# EAGLE design Frankie_KIT (EAGLE 9.1.2)
FRANKIE 1.0
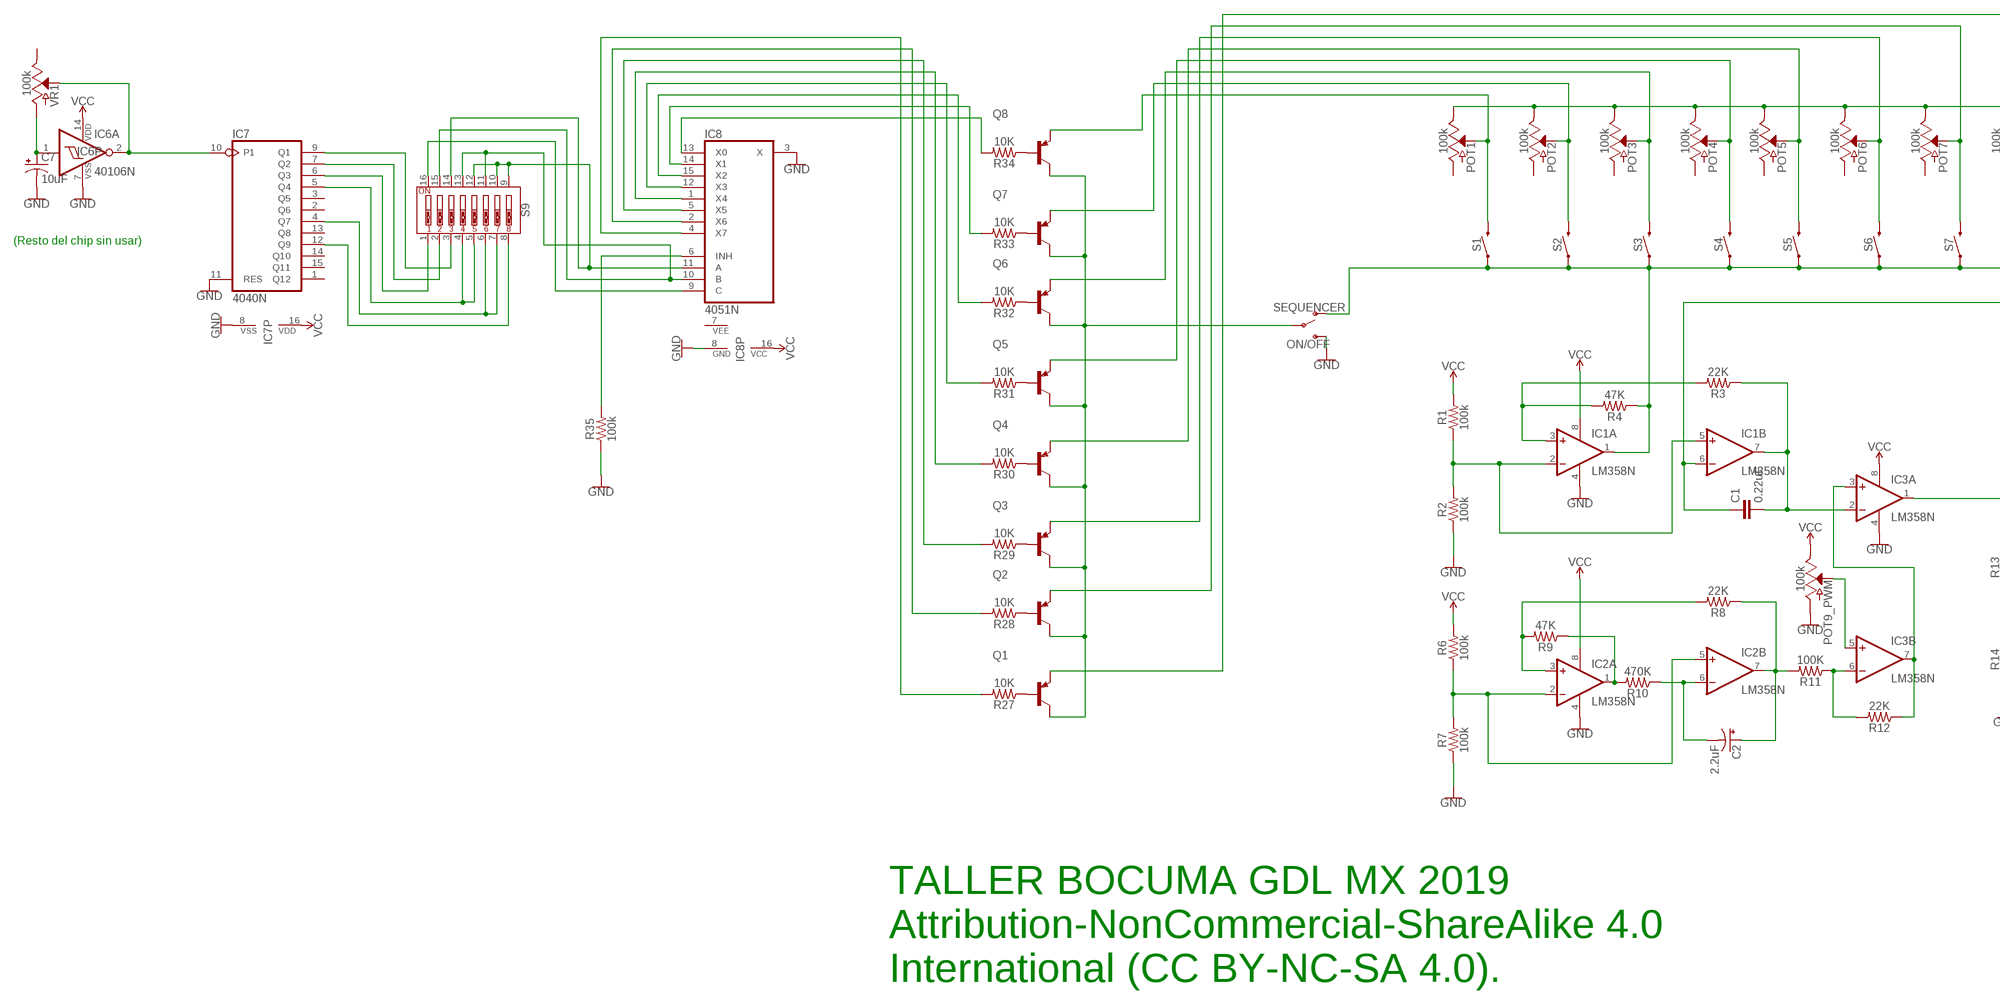
[diagram p0: schematic, sheet 1, part 1 of 2]
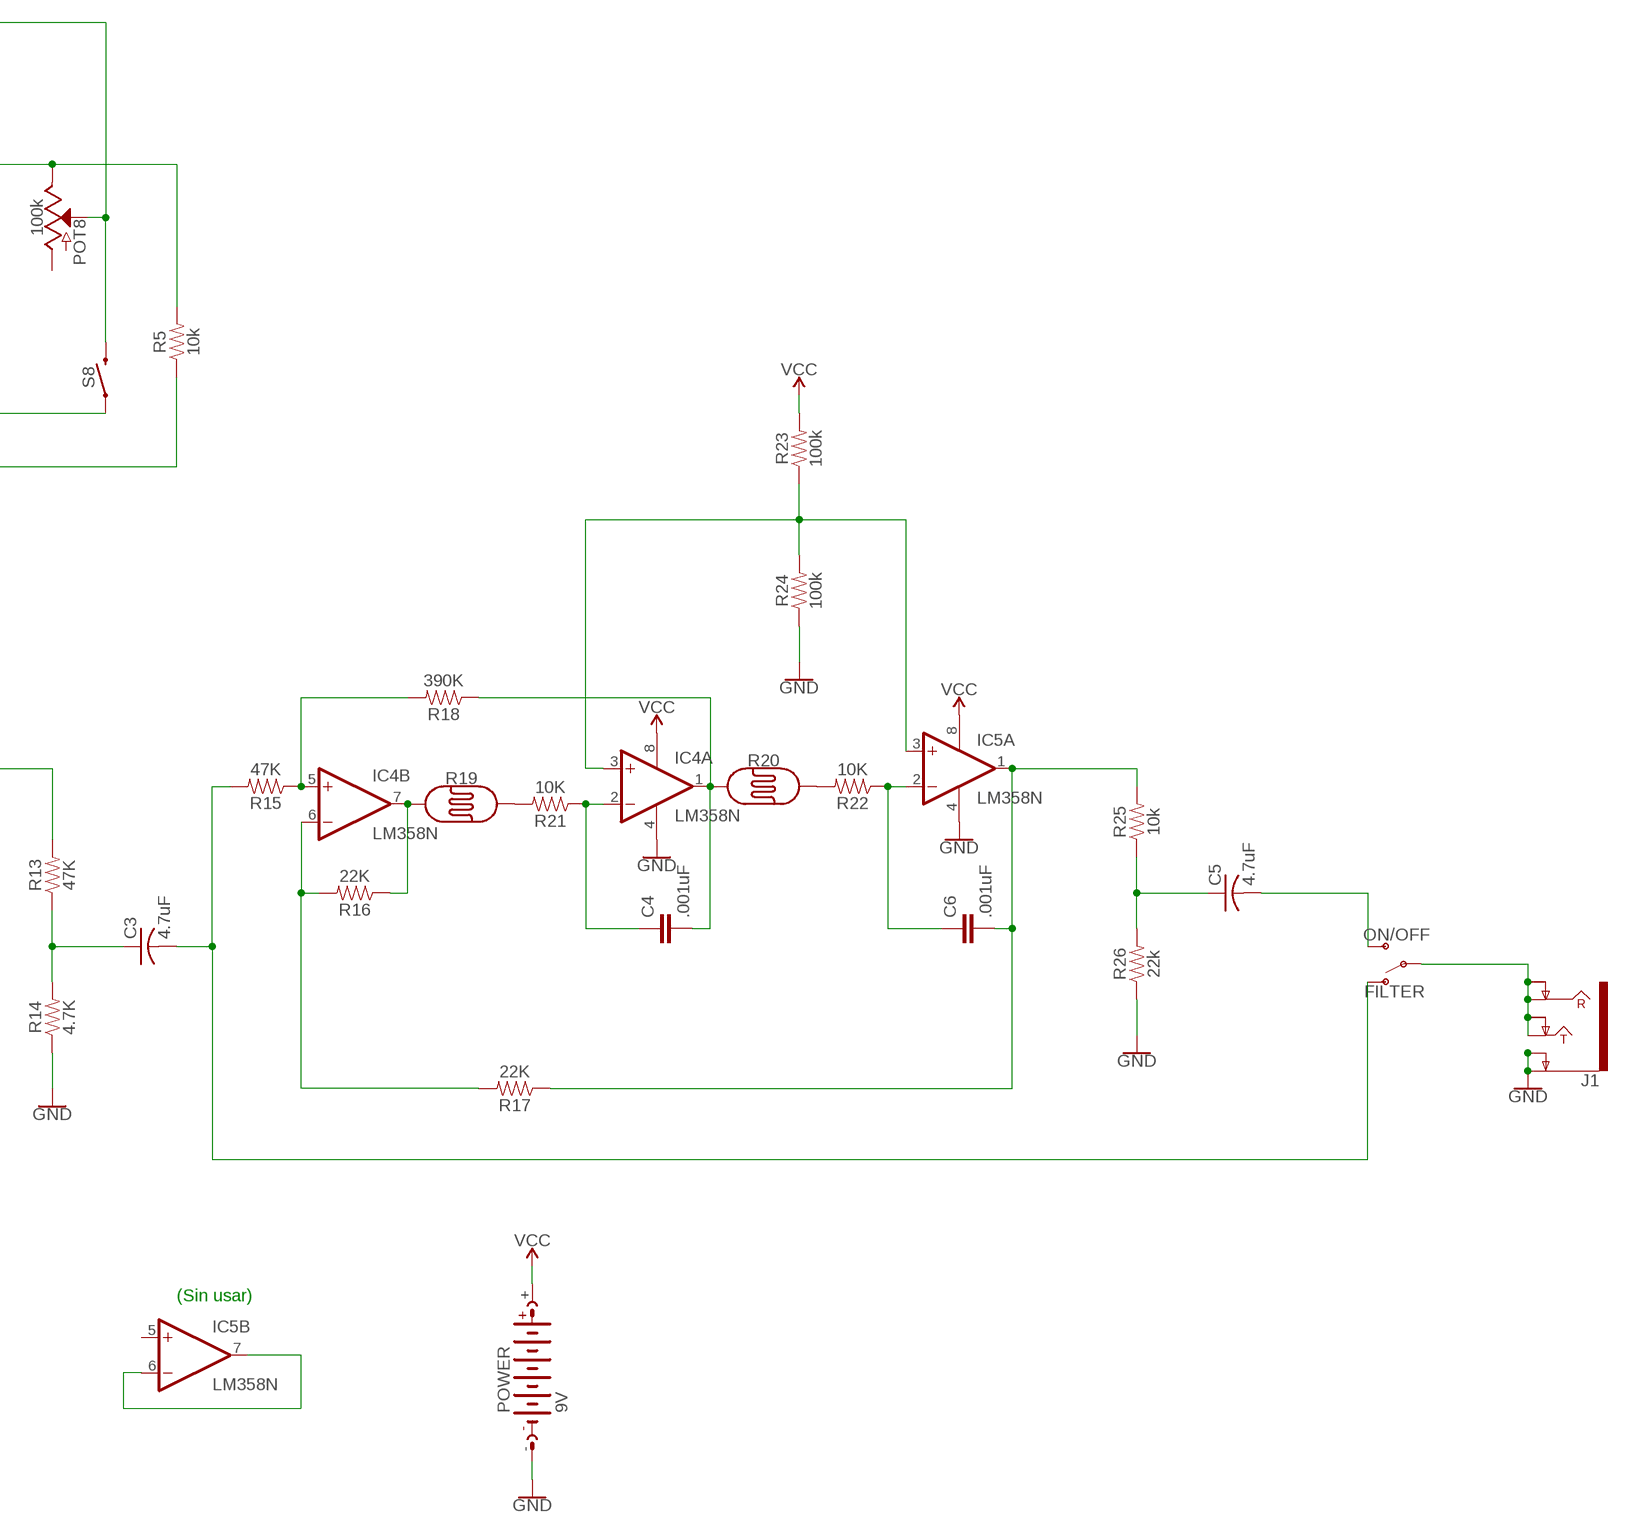
[diagram p1: schematic, sheet 1, part 2 of 2]

## Parts
C1  0.22uF  C5/2.5  [C5B2.5]
C2  2.2uF  10UF-POLAR-RADIAL-2.5MM-KIT-25V-20%  [CPOL-RADIAL-2.5MM-5MM-KIT]
C3  4.7uF  C-US050-025X075  [C050-025X075]
C4  .001uF  C5/2.5  [C5B2.5]
C5  4.7uF  C-US050-025X075  [C050-025X075]
C6  .001uF  C5/2.5  [C5B2.5]
C7  10uF  10UF-POLAR-RADIAL-2.5MM-KIT-25V-20%  [CPOL-RADIAL-2.5MM-5MM-KIT]
FILTER  ON/OFF  SWITCH-SPDT-PTH-11.6X4.0MM-KIT  [SWITCH_SPDT_PTH_11.6X4.0MM_KIT]
IC1  LM358N  [DIL08]
IC2  LM358N  [DIL08]
IC3  LM358N  [DIL08]
IC4  LM358N  [DIL08]
IC5  LM358N  [DIL08]
IC6  40106N  [DIL14]
IC7  4040N  [DIL16]
IC8  4051N  [DIL16]
J1  AUDIO_JACK_TRS_0.25"_PTH_RA  [AUDIO_JACK_0.25"_TRS_PTH_RA]
POT1  100k  POTENTIOMETER-PTH-9MM-1/20W-20%-KIT  [POT-PTH-ALPS-KIT]
POT2  100k  POTENTIOMETER-PTH-9MM-1/20W-20%-KIT  [POT-PTH-ALPS-KIT]
POT3  100k  POTENTIOMETER-PTH-9MM-1/20W-20%-KIT  [POT-PTH-ALPS-KIT]
POT4  100k  POTENTIOMETER-PTH-9MM-1/20W-20%-KIT  [POT-PTH-ALPS-KIT]
POT5  100k  POTENTIOMETER-PTH-9MM-1/20W-20%-KIT  [POT-PTH-ALPS-KIT]
POT6  100k  POTENTIOMETER-PTH-9MM-1/20W-20%-KIT  [POT-PTH-ALPS-KIT]
POT7  100k  POTENTIOMETER-PTH-9MM-1/20W-20%-KIT  [POT-PTH-ALPS-KIT]
POT8  100k  POTENTIOMETER-PTH-9MM-1/20W-20%-KIT  [POT-PTH-ALPS-KIT]
POT9_PWM  100k  POTENTIOMETER-PTH-9MM-1/20W-20%-KIT  [POT-PTH-ALPS-KIT]
POWER  9V  AB9V  [AB9V]
Q1  2N3906  [TO92]
Q2  2N3906  [TO92]
Q3  2N3906  [TO92]
Q4  2N3906  [TO92]
Q5  2N3906  [TO92]
Q6  2N3906  [TO92]
Q7  2N3906  [TO92]
Q8  2N3906  [TO92]
R1  100k  100KOHM-HORIZ-1/4W-5%  [AXIAL-0.3]
R2  100k  100KOHM-HORIZ-1/4W-5%  [AXIAL-0.3]
R3  22K  100KOHM-HORIZ-1/4W-5%  [AXIAL-0.3]
R4  47K  100KOHM-HORIZ-1/4W-5%  [AXIAL-0.3]
R5  10k  100KOHM-HORIZ-1/4W-5%  [AXIAL-0.3]
R6  100k  100KOHM-HORIZ-1/4W-5%  [AXIAL-0.3]
R7  100k  100KOHM-HORIZ-1/4W-5%  [AXIAL-0.3]
R8  22K  100KOHM-HORIZ-1/4W-5%  [AXIAL-0.3]
R9  47K  100KOHM-HORIZ-1/4W-5%  [AXIAL-0.3]
R10  470K  100KOHM-HORIZ-1/4W-5%  [AXIAL-0.3]
R11  100K  100KOHM-HORIZ-1/4W-5%  [AXIAL-0.3]
R12  22K  100KOHM-HORIZ-1/4W-5%  [AXIAL-0.3]
R13  47K  100KOHM-HORIZ-1/4W-5%  [AXIAL-0.3]
R14  4.7K  100KOHM-HORIZ-1/4W-5%  [AXIAL-0.3]
R15  47K  100KOHM-HORIZ-1/4W-5%  [AXIAL-0.3]
R16  22K  100KOHM-HORIZ-1/4W-5%  [AXIAL-0.3]
R17  22K  100KOHM-HORIZ-1/4W-5%  [AXIAL-0.3]
R18  390K  100KOHM-HORIZ-1/4W-5%  [AXIAL-0.3]
R19  PHOTOCELLPTH-KIT  [PHOTOCELL-KIT]
R20  PHOTOCELLPTH-KIT  [PHOTOCELL-KIT]
R21  10K  100KOHM-HORIZ-1/4W-5%  [AXIAL-0.3]
R22  10K  100KOHM-HORIZ-1/4W-5%  [AXIAL-0.3]
R23  100k  100KOHM-HORIZ-1/4W-5%  [AXIAL-0.3]
R24  100k  100KOHM-HORIZ-1/4W-5%  [AXIAL-0.3]
R25  10k  100KOHM-HORIZ-1/4W-5%  [AXIAL-0.3]
R26  22k  100KOHM-HORIZ-1/4W-5%  [AXIAL-0.3]
R27  10K  100KOHM-HORIZ-1/4W-5%  [AXIAL-0.3]
R28  10K  100KOHM-HORIZ-1/4W-5%  [AXIAL-0.3]
R29  10K  100KOHM-HORIZ-1/4W-5%  [AXIAL-0.3]
R30  10K  100KOHM-HORIZ-1/4W-5%  [AXIAL-0.3]
R31  10K  100KOHM-HORIZ-1/4W-5%  [AXIAL-0.3]
R32  10K  100KOHM-HORIZ-1/4W-5%  [AXIAL-0.3]
R33  10K  100KOHM-HORIZ-1/4W-5%  [AXIAL-0.3]
R34  10K  100KOHM-HORIZ-1/4W-5%  [AXIAL-0.3]
R35  100k  100KOHM-HORIZ-1/4W-5%  [AXIAL-0.3]
S1  MOMENTARY-SWITCH-SPST-PTH-12MM  [TACTILE_SWITCH_PTH_12MM]
S2  MOMENTARY-SWITCH-SPST-PTH-12MM  [TACTILE_SWITCH_PTH_12MM]
S3  MOMENTARY-SWITCH-SPST-PTH-12MM  [TACTILE_SWITCH_PTH_12MM]
S4  MOMENTARY-SWITCH-SPST-PTH-12MM  [TACTILE_SWITCH_PTH_12MM]
S5  MOMENTARY-SWITCH-SPST-PTH-12MM  [TACTILE_SWITCH_PTH_12MM]
S6  MOMENTARY-SWITCH-SPST-PTH-12MM  [TACTILE_SWITCH_PTH_12MM]
S7  MOMENTARY-SWITCH-SPST-PTH-12MM  [TACTILE_SWITCH_PTH_12MM]
S8  MOMENTARY-SWITCH-SPST-PTH-12MM  [TACTILE_SWITCH_PTH_12MM]
S9  DIP-08-PTH  [DIPSWITCH-08]
SEQUENCER  ON/OFF  SWITCH-SPDT-PTH-11.6X4.0MM-KIT  [SWITCH_SPDT_PTH_11.6X4.0MM_KIT]
VR1  100k  POTENTIOMETER-PTH-9MM-1/20W-20%-KIT  [POT-PTH-ALPS-KIT]

## Nets
GND [ground]: C7.2(-) IC1.4(P:V-) IC2.4(P:V-) IC3.4(P:V-) IC4.4(P:V-) IC5.4(P:V-) IC6.7(P:VSS) IC7.8(VSS) IC7.11(RES) IC8.3(X) IC8.8(GND) J1.SLEEVE(EARTH) J1.SLEEVE-NORM(EARTH-NORM) POT9_PWM.P$3(A) POWER.- R2.P$1 R7.P$1 R14.P$1 R24.P$1 R26.P$1 R35.P$1 SEQUENCER.3(S)
N$1: IC1.2(A:-IN) IC1.5(B:+IN) R1.P$1 R2.P$2
N$2: C1.2 IC1.7(B:OUT) IC3.2(A:-IN) R3.P$1
N$3: IC1.3(A:+IN) R3.P$2 R4.P$2
N$4: C1.1 IC1.6(B:-IN) R5.P$1
N$5: Q1.1(C) Q2.1(C) Q3.1(C) Q4.1(C) Q5.1(C) Q6.1(C) Q7.1(C) Q8.1(C) SEQUENCER.2(P)
N$6: POT1.P$2(S) Q8.3(E) S1.3
N$7: POT2.P$2(S) Q7.3(E) S2.3
N$8: IC7.5(Q4) S9.4 S9.5
N$9: POT4.P$2(S) Q5.3(E) S4.3
N$10: POT5.P$2(S) Q4.3(E) S5.3
N$11: POT6.P$2(S) Q3.3(E) S6.3
N$12: POT7.P$2(S) Q2.3(E) S7.3
N$13: POT8.P$2(S) Q1.3(E) S8.3
N$14: POT1.P$1(E) POT2.P$1(E) POT3.P$1(E) POT4.P$1(E) POT5.P$1(E) POT6.P$1(E) POT7.P$1(E) POT8.P$1(E) R5.P$2
N$15: IC2.2(A:-IN) IC2.5(B:+IN) R6.P$1 R7.P$2
N$16: IC2.3(A:+IN) R8.P$2 R9.P$2
N$17: IC2.1(A:OUT) R9.P$1 R10.P$2
N$18: C2.2(-) IC2.6(B:-IN) R10.P$1
N$19: IC3.6(B:-IN) R11.P$1 R12.P$2
N$20: C2.1(+) IC2.7(B:OUT) R8.P$1 R11.P$2
N$21: IC3.5(B:+IN) POT9_PWM.P$2(S)
N$22: IC3.3(A:+IN) IC3.7(B:OUT) R12.P$1
N$23: IC3.1(A:OUT) R13.P$2
N$24: IC1.1(A:OUT) R4.P$1 S1.1 S2.1 S3.1 S4.1 S5.1 S6.1 S7.1 S8.1 SEQUENCER.1(O)
N$25: C3.1 R13.P$1 R14.P$2
N$26: IC4.5(B:+IN) R15.P$1 R18.P$2
N$27: C3.2 FILTER.1(O) R15.P$2
N$28: IC4.6(B:-IN) R16.P$2 R17.P$2
N$29: IC4.7(B:OUT) R16.P$1 R19.1
N$30: C6.2 IC5.1(A:OUT) R17.P$1 R25.P$2
N$31: C4.2 IC4.1(A:OUT) R18.P$1 R20.1
N$32: R19.2 R21.P$2
N$33: R20.2 R22.P$2
N$34: C4.1 IC4.2(A:-IN) R21.P$1
N$35: C6.1 IC5.2(A:-IN) R22.P$1
N$36: IC5.6(B:-IN) IC5.7(B:OUT)
N$37: IC4.3(A:+IN) IC5.3(A:+IN) R23.P$1 R24.P$2
N$38: C5.1 R25.P$1 R26.P$2
N$39: FILTER.2(P) J1.RING J1.RING-NORM J1.TIP J1.TIP-NORM
N$40: Q1.2(B) R27.P$1
N$41: C5.2 FILTER.3(S)
N$42: Q2.2(B) R28.P$1
N$43: Q3.2(B) R29.P$1
N$44: Q4.2(B) R30.P$1
N$45: Q5.2(B) R31.P$1
N$46: Q6.2(B) R32.P$1
N$47: Q7.2(B) R33.P$1
N$48: Q8.2(B) R34.P$1
N$49: C7.1(+) IC6.1(A:I) VR1.P$3(A)
N$50: IC6.2(A:O) IC7.10(P1) VR1.P$2(S)
N$51: IC7.9(Q1) S9.3
N$52: IC7.12(Q9) S9.8
N$53: IC7.6(Q3) S9.1
N$54: IC8.11(A) S9.9 S9.10 S9.12 S9.14
N$55: IC8.10(B) S9.11 S9.13 S9.15
N$56: IC8.9(C) S9.16
N$57: IC8.6(INH) R35.P$2
N$59: IC8.13(X0) R34.P$2
N$60: IC8.14(X1) R33.P$2
N$61: IC8.15(X2) R32.P$2
N$62: IC8.12(X3) R31.P$2
N$63: IC8.1(X4) R30.P$2
N$64: IC8.5(X5) R29.P$2
N$65: IC8.2(X6) R28.P$2
N$66: IC8.4(X7) R27.P$2
N$67: IC7.7(Q2) S9.2
N$68: IC7.4(Q7) S9.6 S9.7
N$69: POT3.P$2(S) Q6.3(E) S3.3
VCC: IC1.8(P:V+) IC2.8(P:V+) IC3.8(P:V+) IC4.8(P:V+) IC5.8(P:V+) IC6.14(P:VDD) IC7.16(VDD) IC8.16(VCC) POT9_PWM.P$1(E) POWER.+ R1.P$2 R6.P$2 R23.P$2
Unconnected: IC5.5(B:+IN) IC6.3(B:I) IC6.4(B:O) IC6.5(C:I) IC6.6(C:O) IC6.8(D:O) IC6.9(D:I) IC6.10(E:O) IC6.11(E:I) IC6.12(F:O) IC6.13(F:I) IC7.1(Q12) IC7.2(Q6) IC7.3(Q5) IC7.13(Q8) IC7.14(Q10) IC7.15(Q11) POT1.P$3(A) POT2.P$3(A) POT3.P$3(A) POT4.P$3(A) POT5.P$3(A) POT6.P$3(A) POT7.P$3(A) POT8.P$3(A) VR1.P$1(E)

## Notes on the sheet
- (Resto del chip sin usar)
- (Sin usar)
- TALLER BOCUMA GDL MX 2019
  Attribution-NonCommercial-ShareAlike 4.0
  International (CC BY-NC-SA 4.0).

## Power pins joined to a net without a drawn wire
VEE: IC8.7(VEE)

## Library data of the parts
C1 C4 C6 = capacitor-wima:C: CAPACITOR naming: grid - package width
C2 = SparkFun-Capacitors:10UF-POLAR: 10.0µF polarized capacitors A capacitor is a passive two-terminal electrical component used to store electrical energy temporarily in an electric field.; PROD_ID: CAP-08440; VALUE: 10uF
C3 C5 = rcl:C-US: CAPACITOR, American symbol
C7 = SparkFun-Capacitors:10UF-POLAR: 10.0µF polarized capacitors A capacitor is a passive two-terminal electrical component used to store electrical energy temporarily in an electric field.; PROD_ID: CAP-08440
FILTER SEQUENCER = SparkFun-Switches:SWITCH-SPDT: Single Pole, Double Throw (SPDT) Switch Single-pole, double-throw (SPDT) switch. Variant Overview SMD-AYZ0202 Surface Mount DPDT Switch <https://www.sparkfun.com/products/597> (COM-00597) Used on e.g. LilyPad Arduino USB - ATmega32U4 Board <https://www.sparkfun.com/products/12049> PTH-11.6X4.0MM SPDT Mini Power Switch <https://www.sparkfun.com/products/102> (COM-00102) Used on e.g. SparkFun Simon Says - Through-Hole Soldering Kit <https://www.sparkfun.com/products/10547> (KIT-10547) PTH-11.6X4.0MM-KIT KIT version of SPDT Mini Power Switch - Simplifies soldering by removing tStop of switch pins - only one side can be soldered. PTH-11.6X4.0MM-LOCK LOCK version of SPDT Mini Power Switch - Offset pins hold switch in place for easier soldering. SMD-RIGHT-ANGLE Surface Mount Right Angle Switch <https://www.sparkfun.com/products/10860> (COM-10860) Used on e.g. SparkFun ESP8266 Thing <https://www.sparkfun.com/products/13231>; PROD_ID: SWCH-08261; SF_SKU: COM-00102
IC1-IC5 = linear:LM358: OP AMP also LM158; LM258; LM2904 Source: http://cache.national.com/ds/LM/LM158.pdf
IC6 = 40xx:40106: Hex SCHMITT TRIGGER
IC7 = 40xx:4040: 12-stage binary/ripple COUNTER
IC8 = 40xx:4051: 8-channel ANALOG MULTIPLEXER
J1 = SparkFun-Connectors:AUDIO_JACK_TRS_0.25"_PTH_RA: Audio Jack, 1/4" TRS jack, horizontal, PTH, aka "Phono jack" Find the connector here: Audio Jack - 1/4" Stereo (right angle) <https://www.sparkfun.com/products/11144> (COM-11144) Datasheet <http://cdn.sparkfun.com/datasheets/Components/General/JP-611%20DD.jpg> Note, although the datasheet and physical part are slightly different, this footprint was proven to mate well on the Proto Pedal. This device is used on these SparkFun Products: SparkFun TRS Jack Breakout - 1/4" Stereo <https://www.sparkfun.com/products/13005> (BOB-13005 ) SparkFun Proto Pedal - sorry bad link - product comming soon! <https://www.sparkfun.com/products/13124> (PRT-13124); PROD_ID: CONN-12339; SF_ID: COM-11144
POT1-POT8 POT9_PWM VR1 = SparkFun-Resistors:POTENTIOMETER: Potentiometer (Pot) Three-terminal potentiometers, with an adjustable wiper and two adjustable resistors. A pot can be used to create a configurable voltage divider, or as a variable resistor. Variants ALPS_POT and ALPS_POT_KIT - PTH, breadboard compatible, 9mm square pots Rotary Potentiometer - Linear (10k ohm) <https://www.sparkfun.com/products/9288> (COM-09288) The KIT variant exposes copper on only one side of the PTH pad, so the part can only be assembled on one side of the PCB. Useful for beginner soldering kits.; PROD_ID: RES-09177; SF_SKU: COM-09288; VALUE: 10k
POWER = battery:AB9V: 9-V BATTERY CLIP
Q1-Q8 = transistor-pnp:2N3906: PNP Transistor
R1 R2 R6 R7 R23 R24 R35 = SparkFun-Resistors:100KOHM: 100kΩ resistor A resistor is a passive two-terminal electrical component that implements electrical resistance as a circuit element. Resistors act to reduce current flow, and, at the same time, act to lower voltage levels within circuits. - Wikipedia; PROD_ID: RES-10686
R3-R5 R8-R18 R21 R22 R25-R34 = SparkFun-Resistors:100KOHM: 100kΩ resistor A resistor is a passive two-terminal electrical component that implements electrical resistance as a circuit element. Resistors act to reduce current flow, and, at the same time, act to lower voltage levels within circuits. - Wikipedia; PROD_ID: RES-10686; VALUE: 100k
R19 R20 = SparkFun-Sensors:PHOTOCELL: Photocell (Photodetector, Photo Resistor, CdS) This is a very small light sensor. A photocell changes (also called a photodetector, photo resistor, CdS or photoconductive cell) resistance depending on the amount of light it is exposed to. These little sensors make great ambient light triggers (when light in the room turns on, do something). Datasheet <http://cdn.sparkfun.com/datasheets/Sensors/LightImaging/SEN-09088.pdf> SparkFun Products Mini Photocell <https://www.sparkfun.com/products/9088> (SEN-09088); PROD_ID: COMP-09129; SF_ID: SEN-09088
S1-S8 = SparkFun-Switches:MOMENTARY-SWITCH-SPST: Momentary Switch (Pushbutton) - SPST Normally-open (NO) SPST momentary switches (buttons, pushbuttons). Variants PTH-12MM - 12mm square, through-hole Momentary Pushbutton Switch - 12mm Square <https://www.sparkfun.com/products/9190> (COM-09190) PTH-6.0MM, PTH-6.0MM-KIT - 6.0mm square, through-hole Mini Pushbutton Switch <https://www.sparkfun.com/products/97> (COM-00097) KIT package intended for soldering kit's - only one side of pads' copper is exposed. PTH-RIGHT-ANGLE-KIT - Right-angle, through-hole Right Angle Tactile Button <https://www.sparkfun.com/products/10791> - Used on SparkFun BigTime Watch Kit <https://www.sparkfun.com/products/11734> SMD-12MM - 12mm square, surface-mount Tactile Button - SMD (12mm) <https://www.sparkfun.com/products/12993> (COM-12993) Used on SparkFun PicoBoard <https://www.sparkfun.com/products/11888> SMD-4.5MM - 4.5mm Square Trackball Switch Used on SparkFun Blackberry Trackballer Breakout <https://www.sparkfun.com/products/13169> SMD-4.6MMX2.8MM - 4.60mm x 2.80mm, surface mount Used on SparkFun SAMD21 Mini Breakout <https://www.sparkfun.com/products/13664> SMD-5.2MM, SMD-5.2-REDUNDANT - 5.2mm square, surface-mount Mini Pushbutton Switch - SMD <https://www.sparkfun.com/products/8720> (COM-08720) Used on Arduino Pro Mini <https://www.sparkfun.com/products/11114> REDUNDANT package connects both switch circuits together SMD-6.0X3.5MM - 6.0 x 3.5mm, surface mount Momentary Reset Switch SMD <https://www.sparkfun.com/products/8229> (COM-08229) SMD-6.2MM-TALL - 6.2mm square, surface mount Tactile Button - SMD (6mm) <https://www.sparkfun.com/products/12992> Used on SparkFun Digital Sandbox <https://www.sparkfun.com/products/12651> SMD-RIGHT-ANGLE - Right-angle, surface mount Used on SparkFun Block for Intel® Edison - Arduino <https://www.sparkfun.com/products/13036>; PROD_ID: SWCH-09185; SF_SKU: COM-09190
S9 = SparkFun-Switches:DIP-08: 8-Position DIP Switch 8-circuit DIP (dual inline package) switch. Commonly used to physcially set a circuit's behavior. SparkFun Products DIP Switch - 8 Position <https://www.sparkfun.com/products/8034> (COM-08034); PROD_ID: SWCH-12197; SF_SKU: COM-08034

## Net classes
0 default: width 0.406 mm
1 ground: width 0.61 mm

## Board
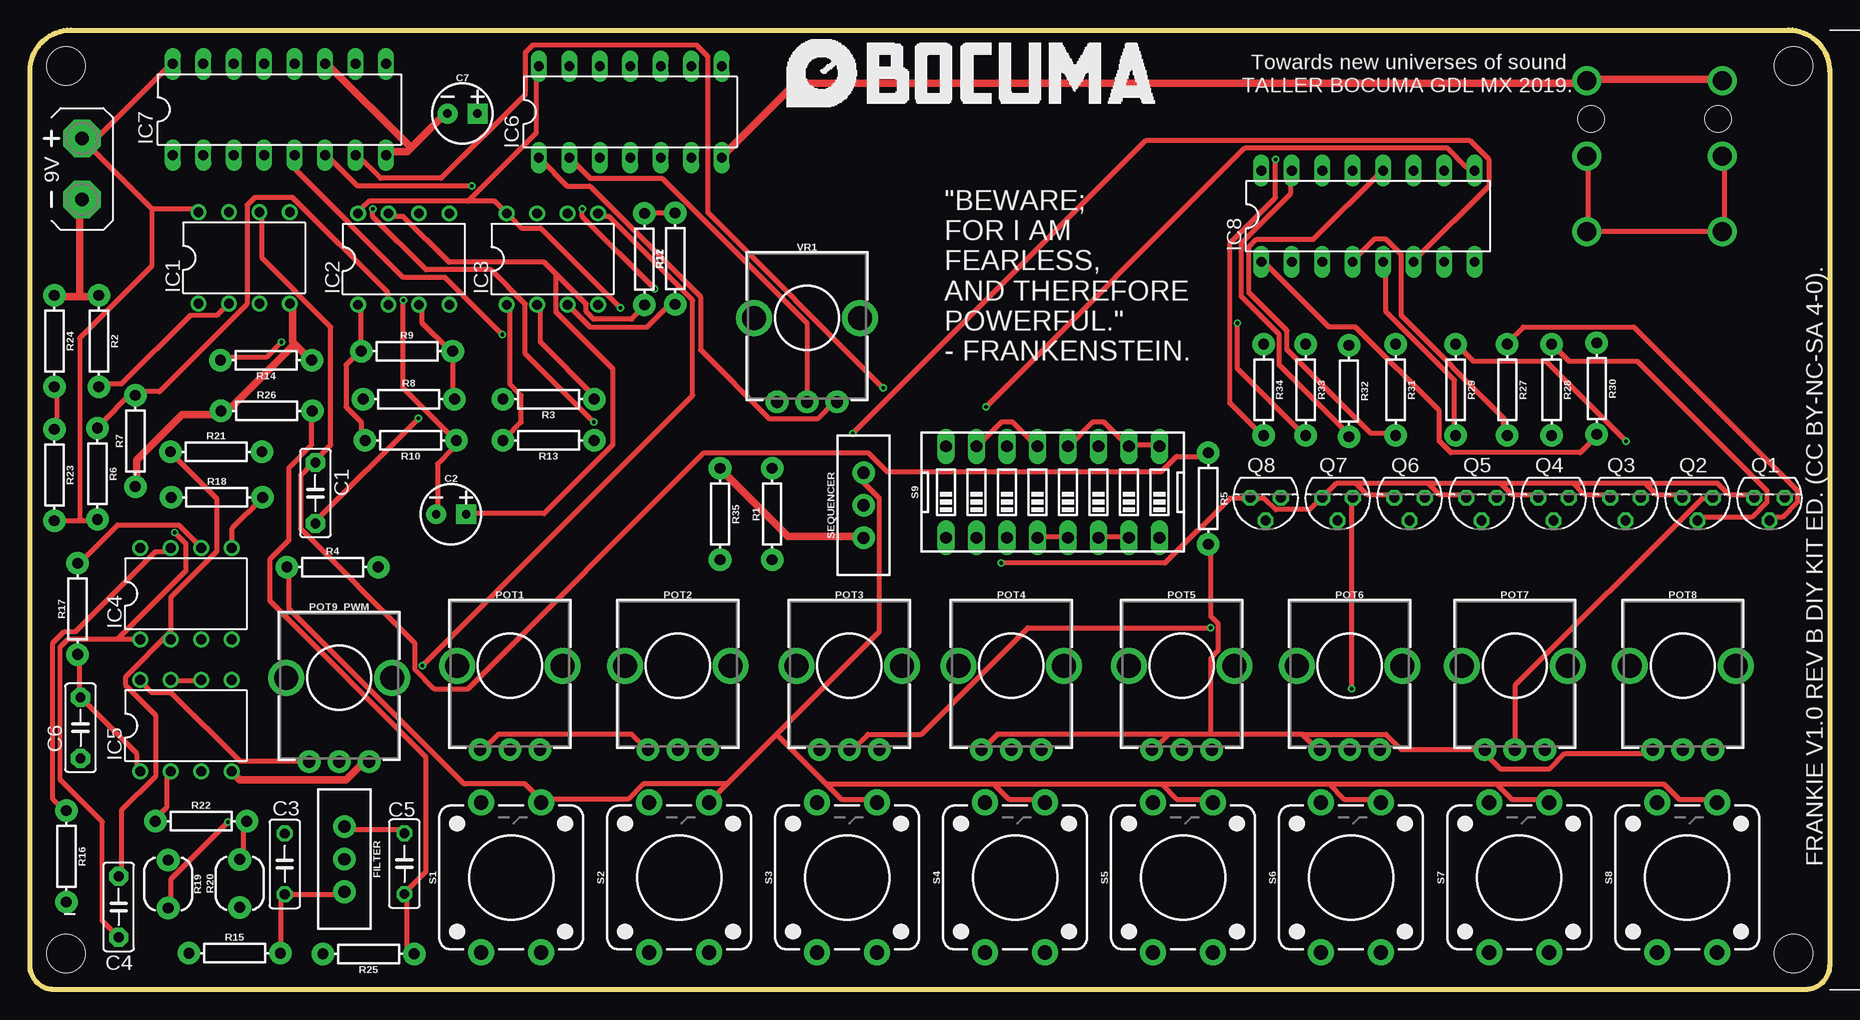
[diagram p2: board, top side]
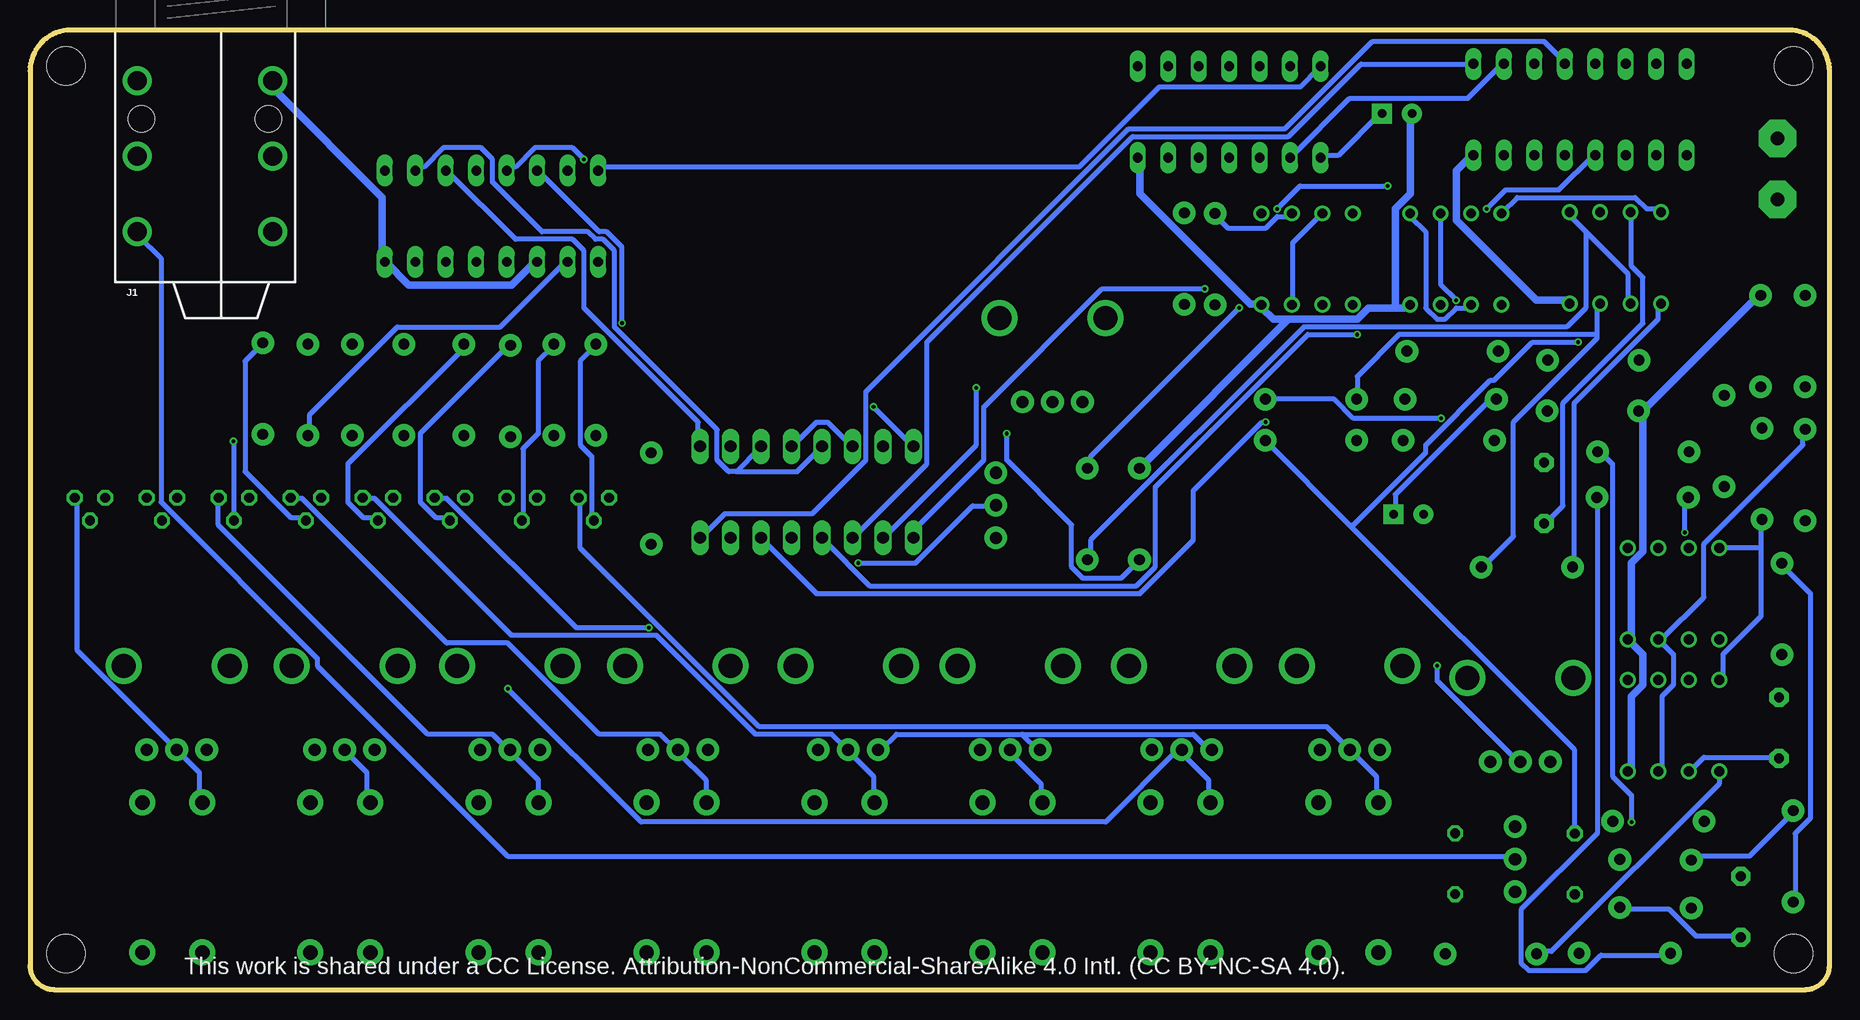
[diagram p3: board, bottom side, seen from below]

Size 150 x 80 mm. Coordinates in mm from the lower left corner, seen from the top.
Outline: 148,0 2,0 arc-90 0,2 0,76.59 arc-90 3.41,80 146.59,80 arc-90 150,76.59 150,2 arc-90 148,0
Copper layers (1*16): Top 0.035mm / dielectric 1.5mm / Bottom 0.035mm
Design rules "dirt_cheap_dirty_boards.v1": minimum track width 5mil, minimum drill 12mil, track to track 5mil, track to pad 5mil, pad to pad 5mil, via to via 5mil, smd to smd 0mil, copper to edge 10mil, drill to drill 10mil, minimum pad ring 10mil, minimum via ring 6mil, stop-mask expansion 2mil, vias tented up to drill 25mil, thermal gap 10mil
Holes 3.2 mm at 3,3 147,77 147,3 3,77

### Footprints (pad centres in the part's own frame; a part is rotated, then mirrored left to right if it is on the bottom)
C5B2.5 = drill 0.813 pad 1.6 octagon: 1 -2.54,0; 2 2.54,0
CPOL-RADIAL-2.5MM-5MM-KIT = drill 0.7 pad 1.651 square: 1 1.25,0 | drill 0.7 pad 1.651: 2 -1.25,0
C050-025X075 = drill 0.813 octagon: 1 -2.54,0; 2 2.54,0
SWITCH_SPDT_PTH_11.6X4.0MM_KIT = drill 1.016 pad 1.88: 1 0,2.718; 2 0,0; 3 0,-2.718
DIL08 = drill 0.813 pad 1.27: 1 -3.81,-3.81; 2 -1.27,-3.81; 3 1.27,-3.81; 4 3.81,-3.81; 5 3.81,3.81; 6 1.27,3.81; 7 -1.27,3.81; 8 -3.81,3.81
DIL14 = drill 0.813 long: 1 -7.62,-3.81; 2 -5.08,-3.81; 3 -2.54,-3.81; 4 0,-3.81; 5 2.54,-3.81; 6 5.08,-3.81; 7 7.62,-3.81; 8 7.62,3.81; 9 5.08,3.81; 10 2.54,3.81; 11 0,3.81; 12 -2.54,3.81; 13 -5.08,3.81; 14 -7.62,3.81
DIL16 = drill 0.813 long: 1 -8.89,-3.81; 2 -6.35,-3.81; 3 -3.81,-3.81; 4 -1.27,-3.81; 5 1.27,-3.81; 6 3.81,-3.81; 7 6.35,-3.81; 8 8.89,-3.81; 9 8.89,3.81; 10 6.35,3.81; 11 3.81,3.81; 12 1.27,3.81; 13 -1.27,3.81; 14 -3.81,3.81; 15 -6.35,3.81; 16 -8.89,3.81
AUDIO_JACK_0.25"_TRS_PTH_RA = drill 1.6: RING 10.5,-6.95; RING-NORM 10.5,4.35; SLEEVE 4.2,-6.95; SLEEVE-NORM 4.2,4.35; TIP 16.8,-6.95; TIP-NORM 16.8,4.35 | hole 2.2: 7.4,4; 7.4,-6.6
POT-PTH-ALPS-KIT = drill 1 pad 1.88: P$1 7,-2.5; P$2 7,0; P$3 7,2.5 | drill 2: P$4 0,-4.4; P$5 0,4.4
AB9V = drill 1.118 pad 3.15 octagon: + 0,2.54; - 0,-2.54
TO92 = drill 0.813 octagon: 1 1.27,0; 2 0,1.905; 3 -1.27,0
AXIAL-0.3 = drill 0.9 pad 1.88: P$1 -3.81,0; P$2 3.81,0
PHOTOCELL-KIT = drill 0.9 pad 1.88: 1 -2,0; 2 2,0
TACTILE_SWITCH_PTH_12MM = drill 1.2 pad 2.159: 1 6.25,-2.5; 2 -6.25,-2.5; 3 6.25,2.5; 4 -6.25,2.5
DIPSWITCH-08 = drill 0.97 long: 1 -8.89,-3.81; 2 -6.35,-3.81; 3 -3.81,-3.81; 4 -1.27,-3.81; 5 1.27,-3.81; 6 3.81,-3.81; 7 6.35,-3.81; 8 8.89,-3.81; 9 8.89,3.81; 10 6.35,3.81; 11 3.81,3.81; 12 1.27,3.81; 13 -1.27,3.81; 14 -3.81,3.81; 15 -6.35,3.81; 16 -8.89,3.81

### Placement (x,y rotation side)
C1  23.79,41.4 270 top
C2  35.1,39.63 0 top
C3  21.23,10.47 270 top
C4  7.39,6.89 270 top
C5  31.21,10.49 90 top
C6  4.21,21.82 90 top
C7  36.05,73.03 0 top
FILTER  26.2,10.87 180 top
IC1  17.85,61 0 top
IC2  31.15,60.9 0 top
IC3  43.55,60.9 0 top
IC4  13,33 0 top
IC5  13,22 0 top
IC6  50.04,73.17 0 top
IC7  20.79,73.37 0 top
IC8  111.53,64.47 0 top
J1  134.11,79.98 270 bottom
POT1  40,27 270 top
POT2  54,27 270 top
POT3  68.3,27 270 top
POT4  81.8,27 270 top
POT5  96,27 270 top
POT6  110,27 270 top
POT7  123.77,27 270 top
POT8  137.77,27 270 top
POT9_PWM  25.77,26 270 top
POWER  4.34,68.41 0 top
Q1  145,41 180 top
Q2  139,41 180 top
Q3  133,41 180 top
Q4  127,41 180 top
Q5  121,41 180 top
Q6  115,41 180 top
Q7  109,41 180 top
Q8  103,41 180 top
R1  61.86,39.64 90 top
R2  5.74,54.06 270 top
R3  43.22,49.22 180 top
R4  25.22,35.22 0 top
R5  98.22,40.94 270 top
R6  5.62,43 270 top
R7  8.78,45.74 90 top
R8  31.58,49.22 0 top
R9  31.42,53.22 0 top
R10  31.74,45.78 180 top
R11  51.22,60.9 270 top
R12  53.78,60.94 90 top
R13  43.22,45.78 180 top
R14  19.68,52.47 180 top
R15  17.06,3.03 0 top
R16  3.03,11.1 270 top
R17  3.97,31.74 90 top
R18  15.58,41.03 0 top
R19  11.52,8.8 270 top
R20  17.48,8.85 90 top
R21  15.52,44.83 0 top
R22  14.26,14.03 0 top
R23  2.03,42.9 270 top
R24  2.03,54.06 270 top
R25  28.22,2.97 180 top
R26  19.72,48.24 0 top
R27  123.14,50 270 top
R28  126.84,50 270 top
R29  118.84,50 270 top
R30  130.6,50.1 270 top
R31  113.84,50 270 top
R32  109.94,49.9 270 top
R33  106.34,50 270 top
R34  102.84,50 270 top
R35  57.52,39.64 270 top
S1  40.11,9.34 90 top
S2  54.11,9.34 90 top
S3  68.11,9.34 90 top
S4  82.11,9.34 90 top
S5  96.11,9.34 90 top
S6  110.11,9.34 90 top
S7  124.14,9.34 90 top
S8  138.14,9.34 90 top
S9  85.25,41.47 0 top
SEQUENCER  69.49,40.37 0 top
VR1  64.77,55.99 270 top

### Tracks (layer width: path | path; a pad name or v marks a point on that pad's centre or on a via)
GND
  Top 0.61: POT9_PWM.P$3 28.26,18.73 27.62,18.73 26.35,17.46 17.46,17.46 16.83,18.1 IC5.4 | 4.13,57.78 5.71,57.78 R2.P$1 | 4.13,57.78 2.22,57.78 R24.P$1 | 4.13,57.78 4.13,65.72 POWER.- | 22.07,53.82 23.18,52.7 R14.P$1 | 22.07,53.82 21.91,53.98 21.91,57.15 IC1.4 | R7.P$1 8.89,42.23 8.89,44.13 12.7,47.94 15.88,47.94 R26.P$1 16.19,47.94 21.91,53.66 22.07,53.82 | J1.SLEEVE 140.97,75.88 129.86,75.88 J1.SLEEVE-NORM 129.54,75.56 63.82,75.56 57.78,69.53 IC6.7 | 31.75,70.17 34.61,73.03 C7.2 | 31.75,70.17 31.43,69.85 29.84,69.85 IC7.8 | 31.75,70.17 24.77,77.15 IC7.11 | SEQUENCER.3 69.22,37.78 63.18,37.78 57.78,43.18 R35.P$1
  Bottom 0.61: IC5.4 16.51,18.41 16.51,24.45 15.56,25.4 15.56,27.94 16.51,28.89 IC4.4 16.51,29.21 16.51,35.56 15.56,36.51 15.56,47.94 R26.P$1 15.88,47.94 6.03,57.78 R2.P$1 | IC8.3 107.95,60.64 109.86,58.74 118.43,58.74 120.33,60.64 IC8.8 120.65,60.96 120.65,66.04 129.54,74.93 129.54,75.56 J1.SLEEVE-NORM | 36.2,56.83 38.42,56.83 39.37,55.88 45.09,55.88 | 36.2,56.83 35.24,56.83 IC2.4 | 45.09,55.88 46.35,55.88 47.31,56.83 IC3.4 47.62,57.15 48.26,57.15 57.47,66.36 57.47,69.22 IC6.7 | 45.09,55.88 57.47,43.5 R35.P$1 | 36.2,56.83 36.2,65.09 34.92,66.36 34.92,73.03 C7.2 | IC1.4 21.91,57.47 24.45,57.47 31.11,64.14 31.11,68.26 29.84,69.53 IC7.8
N$1
  Top 0.406: R2.P$2 6.03,50.48 7.62,50.48 13.34,56.2 15.56,56.2 16.51,57.15 IC1.2
  Bottom 0.406: 20.32,63.18 21.91,64.77 IC1.5 | 20.32,63.18 16.83,59.69 16.83,57.47 IC1.2 | 20.32,63.18 20.32,56.83 21.91,55.24 43.81,55.24 61.59,37.47 61.59,35.88 R1.P$1
N$2  (via drill 0.3)
  Top 0.406: IC3.2 42.55,56.83 42.55,53.98 46.99,49.53 R3.P$1 | v32.38,47.62 23.81,39.05 C1.2
  Bottom 0.406: IC1.7 16.51,64.77 16.51,60.33 15.56,59.37 15.56,55.56 22.23,48.9 22.23,40.32 23.5,39.05 C1.2 | v32.38,47.62 39.69,47.62 41.27,49.21 46.99,49.21 R3.P$1
N$3
  Bottom 0.406: 19.37,54.61 19.37,54.29 26.35,47.31 26.35,37.78 28.89,35.24 R4.P$2 | 19.37,54.61 19.37,57.15 IC1.3 | 19.37,54.61 35.88,54.61 39.37,51.12 39.37,49.53 R3.P$2
N$4
  Top 0.406: IC1.6 19.37,64.77 19.37,60.96 25.08,55.24 25.08,45.4 23.81,44.13 C1.1 23.5,43.81 22.54,42.86 22.54,38.42 32.07,28.89 32.07,26.67 33.66,25.08 36.51,25.08 56.2,44.77 69.85,44.77 71.44,43.18 94.3,43.18 95.57,44.45 98.11,44.45 R5.P$1
N$5  (via drill 0.3)
  Top 0.406: 110.49,42.23 111.44,41.27 113.67,41.27 Q6.1 | 110.49,42.23 108.9,42.23 107.95,41.27 Q7.1 107.63,40.96 106.68,40.01 103.82,40.01 102.87,40.96 101.92,40.96 Q8.1 101.6,40.96 100.01,40.96 94.61,35.56 v80.96,35.56 | 116.52,42.23 117.47,41.27 119.7,41.27 Q5.1 | 110.49,42.23 116.52,42.23 | 122.56,42.23 123.51,41.27 125.73,41.27 Q4.1 | 116.52,42.23 122.56,42.23 | 128.59,42.23 129.54,41.27 131.44,41.27 Q3.1 | 122.56,42.23 128.59,42.23 | 134.62,42.23 135.57,41.27 137.48,41.27 Q2.1 | 128.59,42.23 134.62,42.23 | 134.62,42.23 140.65,42.23 141.6,41.27 143.51,41.27 Q1.1
  Bottom 0.406: v80.96,35.56 76.2,35.56 71.44,40.32 69.53,40.32 SEQUENCER.2
N$6
  Bottom 0.406: Q8.3 104.14,40.96 104.14,36.83 89.22,21.91 41.91,21.91 POT1.P$2 39.69,19.68 37.78,17.78 37.78,15.88 S1.3
N$7  (via drill 0.3)
  Top 0.406: v110.17,25.08 110.17,40.96 Q7.3
  Bottom 0.406: v110.17,25.08 99.06,13.97 60.33,13.97 54.29,20 POT2.P$2 53.98,19.68 51.75,17.46 51.75,15.88 S2.3
N$8  (via drill 0.3)
  Top 0.406: v39.37,54.61 34.61,59.37 31.11,59.37 22.23,68.26 22.23,69.53 IC7.5 | S9.5 86.36,37.78 84.14,37.78 S9.4
  Bottom 0.406: v39.37,54.61 43.5,54.61 56.2,41.91 56.2,35.24 57.78,33.66 80.01,33.66 83.82,37.47 S9.4
N$9
  Bottom 0.406: Q5.3 122.24,40.96 121.28,40.96 109.86,29.53 97.79,29.53 89.53,21.27 83.19,21.27 81.92,20 POT4.P$2 81.6,19.68 79.69,17.78 79.69,15.88 S4.3
N$10
  Bottom 0.406: Q4.3 128.27,40.96 127.32,40.96 115.25,28.89 110.17,28.89 102.55,21.27 97.47,21.27 96.2,20 POT5.P$2 95.89,19.68 93.66,17.46 93.66,15.88 S5.3
N$11
  Bottom 0.406: Q3.3 134.3,40.96 134.3,38.73 116.84,21.27 111.44,21.27 110.17,20 POT6.P$2 109.86,19.68 107.63,17.46 107.63,15.88 S6.3
N$12
  Top 0.406: Q2.3 140.02,40.96 139.38,40.96 123.83,25.4 123.83,20 POT7.P$2
  Bottom 0.406: S7.3 121.92,15.88 121.92,18.1 123.51,19.68 POT7.P$2
N$13
  Bottom 0.406: Q1.3 146.05,40.96 146.05,28.26 137.79,20 POT8.P$2 137.48,19.68 135.89,18.1 135.89,15.88 S8.3
N$14
  Top 0.406: POT1.P$1 37.78,20 39.05,21.27 50.16,21.27 51.44,20 POT2.P$1 | 94.93,21.27 93.66,20 POT5.P$1 | 106.05,21.27 98.42,21.27 | 98.42,21.27 94.93,21.27 | 106.05,21.27 107.31,20 POT6.P$1 | 98.42,21.27 98.42,27.62 99.06,28.26 99.06,30.48 98.42,31.11 98.42,36.83 R5.P$2 | 106.05,21.27 113.03,21.27 114.3,20 120.97,20 POT7.P$1 121.28,19.68 122.56,18.41 126.68,18.41 127.95,19.68 135.25,19.68 POT8.P$1 | 94.93,21.27 80.64,21.27 79.38,20 POT4.P$1
  Bottom 0.406: 67.31,21.27 66.04,20 POT3.P$1 | 67.31,21.27 77.79,21.27 79.06,20 POT4.P$1 | 67.31,21.27 53.02,21.27 51.75,20 POT2.P$1
N$15
  Top 0.406: R6.P$1 5.71,46.99 8.57,49.85 R7.P$2 8.89,49.85 10.79,49.85 18.1,57.15 18.1,65.41 18.73,66.04 21.91,66.04 29.84,58.1 29.84,57.15 IC2.2
  Bottom 0.406: IC2.2 30.16,56.83 31.11,56.83 32.07,55.88 32.7,55.88 33.66,56.83 33.66,63.18 34.92,64.45 IC2.5
N$16
  Top 0.406: IC2.3 32.7,56.83 32.7,55.56 34.92,53.34 R9.P$2 35.24,53.02 35.24,49.53 R8.P$2
N$17
  Top 0.406: IC2.1 27.62,56.83 27.62,53.34 R9.P$1 27.3,53.02 26.35,52.07 26.35,48.58 27.62,47.31 27.62,46.04 R10.P$2
N$18  (via drill 0.3)
  Top 0.406: v31.11,57.47 31.11,50.16 35.24,46.04 R10.P$1 35.24,45.72 35.24,45.09 33.97,43.81 33.97,39.69 C2.2
  Bottom 0.406: v31.11,57.47 32.38,58.74 32.38,64.45 IC2.6
N$19
  Top 0.406: R12.P$2 53.66,64.77 51.44,64.77 R11.P$1
  Bottom 0.406: IC3.6 45.09,64.45 46.04,64.45 46.99,63.5 50.16,63.5 51.12,64.45 R11.P$1
N$20
  Top 0.406: 43.81,59.69 46.35,57.15 46.35,56.52 46.99,55.88 50.16,55.88 51.12,56.83 R11.P$2 | 43.81,59.69 42.86,60.64 34.92,60.64 31.11,64.45 30.16,64.45 IC2.7 | 43.81,59.69 43.81,56.52 48.58,51.75 48.58,45.4 42.86,39.69 36.51,39.69 C2.1
  Bottom 0.406: C2.1 36.2,39.69 36.2,41.27 27.94,49.53 R8.P$1
N$21  (via drill 0.3)
  Top 0.406: v32.7,26.99 55.24,49.53 55.24,57.47 48.26,64.45 47.62,64.45 IC3.5
  Bottom 0.406: v32.7,26.99 32.7,25.72 26.04,19.05 POT9_PWM.P$2
N$22
  Top 0.406: R12.P$1 53.66,56.83 53.02,56.83 51.44,55.24 46.67,55.24 45.09,56.83 IC3.3
  Bottom 0.406: IC3.3 44.77,57.15 44.77,62.23 42.55,64.45 IC3.7
N$23
  Top 0.406: IC3.1 40.01,56.83 40.01,50.48 40.96,49.53 40.96,47.31 39.69,46.04 R13.P$2
N$24
  Top 0.406: 58.1,17.14 56.83,15.88 S2.1 | 58.1,17.14 62.23,21.27 | 62.23,21.27 70.8,29.84 70.8,40.96 69.53,42.23 69.53,42.86 SEQUENCER.1 | 58.1,17.14 51.12,17.14 49.85,15.88 42.86,15.88 S1.1 42.55,15.88 41.27,17.14 36.2,17.14 21.59,31.75 21.59,34.92 R4.P$1 | 62.23,21.27 66.36,17.14 | 66.36,17.14 67.63,15.88 70.48,15.88 S3.1 | 80.33,17.14 81.6,15.88 84.45,15.88 S4.1 | 66.36,17.14 80.33,17.14 | 94.3,17.14 95.57,15.88 98.42,15.88 S5.1 | 80.33,17.14 94.3,17.14 | 108.27,17.14 109.54,15.88 112.39,15.88 S6.1 | 94.3,17.14 108.27,17.14 | 122.24,17.14 123.51,15.88 126.36,15.88 S7.1 | 108.27,17.14 122.24,17.14 | 122.24,17.14 136.21,17.14 137.48,15.88 140.34,15.88 S8.1
  Bottom 0.406: IC1.1 14.29,57.15 14.29,55.88 21.27,48.9 21.27,35.24 R4.P$1
N$25  (via drill 0.3)
  Top 0.406: v20.95,53.98 19.68,52.7 15.88,52.7 R14.P$2
  Bottom 0.406: 40.01,38.73 46.99,45.72 R13.P$1 | 40.01,38.73 21.27,20 21.27,13.02 C3.1 | v20.95,53.98 24.77,53.98 27.94,50.8 28.26,50.8 33.66,45.4 33.66,44.77 39.69,38.73 40.01,38.73
N$26
  Top 0.406: IC4.5 16.83,36.83 16.83,38.42 19.37,40.96 R18.P$2
  Bottom 0.406: R15.P$1 13.34,2.86 19.05,2.86 20.32,1.59 25.08,1.59 25.72,2.22 25.72,6.67 19.37,13.02 19.37,40.96 R18.P$2
N$27
  Top 0.406: R15.P$2 20.95,3.17 20.95,7.62 C3.2 21.27,7.94 26.04,7.94 FILTER.1
N$28
  Top 0.406: IC4.6 13.97,36.83 13.97,37.15 12.38,38.73 7.3,38.73 4.13,35.56 R17.P$2
  Bottom 0.406: R16.P$2 2.86,7.3 2.86,13.02 1.59,14.29 1.59,33.02 3.81,35.24 R17.P$2
N$29
  Top 0.406: IC4.7 11.43,36.51 10.48,36.51 3.81,29.84 2.86,29.84 1.91,28.89 1.91,15.88 2.86,14.92 R16.P$1
  Bottom 0.406: R19.1 11.43,11.11 6.67,11.11 3.17,14.61 R16.P$1
N$30
  Top 0.406: IC5.1 8.89,18.41 8.89,19.68 4.45,24.13 C6.2 4.13,24.45 4.13,27.62 R17.P$1
  Bottom 0.406: R25.P$2 24.13,3.17 23.18,3.17 9.21,17.14 9.21,18.1 IC5.1
N$31  (via drill 0.3)
  Top 0.406: 7.3,29.21 3.17,29.21 2.54,28.57 2.54,17.46 6.03,13.97 6.03,5.71 7.3,4.45 C4.2 | 7.3,29.21 8.89,29.21 IC4.1 | v12.06,38.1 13.02,37.15 13.02,34.92 7.3,29.21
  Bottom 0.406: R20.1 17.46,6.67 13.34,6.67 11.11,4.45 7.62,4.45 C4.2 | v12.06,38.1 12.06,40.96 R18.P$1
N$32  (via drill 0.3)
  Top 0.406: v16.51,13.97 11.75,9.21 11.75,6.99 R19.2
  Bottom 0.406: v16.51,13.97 16.51,16.19 18.1,17.78 18.1,43.81 19.05,44.77 R21.P$2
N$33
  Top 0.406: R20.2 17.78,11.11 17.78,13.97 R22.P$2
N$34
  Top 0.406: 11.75,29.84 11.75,32.7 15.56,36.51 15.56,40.96 11.75,44.77 R21.P$1 | 11.75,29.84 11.75,29.21 IC4.2 11.75,29.84 | 11.75,29.84 7.94,26.04 7.94,25.4 10.48,22.86 10.48,17.78 7.62,14.92 7.62,9.53 C4.1
N$35
  Top 0.406: IC5.2 11.43,18.1 11.43,15.24 10.48,14.29 R22.P$1
  Bottom 0.406: C6.1 4.45,19.37 10.48,19.37 11.43,18.41 IC5.2
N$36
  Top 0.406: IC5.7 11.75,25.72 13.97,25.72 IC5.6
N$37
  Top 0.406: R23.P$1 2.22,46.99 2.22,50.16 R24.P$2
  Bottom 0.406: IC5.3 13.97,18.41 13.97,24.45 13.02,25.4 13.02,27.94 13.97,28.89 IC4.3 13.97,29.21 10.48,32.7 10.48,37.15 2.22,45.4 2.22,46.67 R23.P$1
N$38
  Top 0.406: R25.P$1 31.75,3.17 31.43,3.49 31.43,7.94 C5.1 31.43,8.26 33.02,9.84 33.02,19.37 20,32.38 20,35.88 21.59,37.47 21.59,43.5 23.5,45.4 23.5,47.94 R26.P$2
N$39
  Top 0.406: 129.86,63.18 129.86,69.22 J1.RING-NORM | 129.86,63.18 J1.TIP-NORM 129.86,63.18 | J1.RING 141.29,69.22 141.29,63.18 J1.TIP 140.97,63.18 129.86,63.18
  Bottom 0.406: FILTER.2 26.35,11.11 110.17,11.11 126.05,26.99 126.05,27.62 139.06,40.64 139.06,60.96 140.97,62.87 J1.TIP
N$40
  Top 0.406: Q1.2 145.1,39.37 146.05,39.37 147.32,40.64 147.32,41.59 133.67,55.24 124.46,55.24 123.19,53.98 R27.P$1
N$41
  Top 0.406: C5.2 31.11,13.34 26.35,13.34 FILTER.3
N$42
  Top 0.406: Q2.2 139.06,39.37 143.51,39.37 144.78,40.64 144.78,41.59 133.99,52.39 128.27,52.39 127,53.66 R28.P$1
N$43  (via drill 0.3)
  Top 0.406: v133.03,45.72 126.36,52.39 120.33,52.39 119.06,53.66 R29.P$1
  Bottom 0.406: v133.03,45.72 133.03,39.37 Q3.2
N$44
  Bottom 0.406: Q4.2 127,39.37 128.27,39.37 132.08,43.18 132.08,52.39 130.81,53.66 R30.P$1
N$45
  Bottom 0.406: Q5.2 121.28,39.37 122.24,39.37 123.51,40.64 123.51,43.81 113.67,53.66 R31.P$1
N$46
  Bottom 0.406: Q6.2 115.25,39.37 116.2,39.37 117.47,40.64 117.47,46.35 110.17,53.66 R32.P$1
N$47
  Bottom 0.406: Q7.2 108.9,39.37 108.9,45.09 107.63,46.35 107.63,52.39 106.36,53.66 R33.P$1
N$48
  Bottom 0.406: Q8.2 103.19,39.37 103.19,44.45 104.14,45.4 104.14,52.39 102.87,53.66 R34.P$1
N$49
  Top 0.406: VR1.P$3 66.99,48.9 65.72,47.62 61.59,47.62 55.88,53.34 55.88,57.78 46.67,66.99 44.77,66.99 42.55,69.22 IC6.1
  Bottom 0.406: IC6.1 42.23,69.53 40.96,69.53 37.47,73.03 C7.1
N$50
  Top 0.406: VR1.P$2 64.77,49.21 64.77,55.56 52.7,67.63 46.67,67.63 45.09,69.22 IC6.2
  Bottom 0.406: IC7.10 27.3,77.15 30.16,74.3 40.01,74.3 44.77,69.53 IC6.2
N$51
  Bottom 0.406: IC7.9 29.84,77.15 39.05,77.15 45.09,71.12 58.1,71.12 75.25,53.98 75.25,43.81 81.28,37.78 S9.3
N$52
  Bottom 0.406: IC7.12 22.23,77.47 23.81,79.06 38.1,79.06 45.4,71.75 58.42,71.75 80.33,49.85 80.33,44.13 84.77,39.69 92.08,39.69 93.98,37.78 S9.8
N$53  (via drill 0.3)
  Top 0.406: v36.83,66.99 27.3,66.99 24.77,69.53 IC7.6 | v46.04,65.09 46.04,64.45 v52.07,58.42
  Bottom 0.406: v36.83,66.99 44.13,66.99 v46.04,65.09 | v52.07,58.42 60.64,58.42 70.48,48.58 70.48,44.13 76.2,38.42 76.2,37.78 S9.1
N$54
  Top 0.406: S9.9 93.98,45.4 91.76,45.4 S9.10 91.44,45.4 89.53,47.31 88.58,47.31 86.68,45.4 S9.12
  Bottom 0.406: S9.14 81.6,45.4 83.5,47.31 84.45,47.31 86.36,45.4 S9.12 | IC8.11 115.25,68.26 109.54,62.55 104.78,62.55 103.82,61.59 103.82,56.83 94.3,47.31 94.3,45.4 S9.9
N$55
  Top 0.406: S9.15 79.06,45.4 80.96,47.31 81.92,47.31 83.82,45.4 S9.13
  Bottom 0.406: 91.12,43.18 91.76,43.18 92.71,44.13 92.71,46.67 101.28,55.24 101.28,61.59 102.23,62.55 102.87,62.55 103.5,63.18 107.31,63.18 111.44,67.31 111.44,69.22 112.39,70.17 115.57,70.17 117.16,68.58 117.79,68.58 IC8.10 | 91.12,43.18 89.22,45.09 S9.11 | 91.12,43.18 86.04,43.18 84.14,45.09 S9.13
N$56  (via drill 0.3)
  Top 0.406: v79.69,48.58 101.28,70.17 118.11,70.17 119.7,68.58 120.33,68.58 IC8.9
  Bottom 0.406: v79.69,48.58 76.52,45.4 S9.16
N$57  (via drill 0.3)
  Top 0.406: v68.58,46.35 93.03,70.8 120.02,70.8 121.6,69.22 121.6,66.99 115.57,60.96 IC8.6
  Bottom 0.406: v68.58,46.35 68.58,44.13 63.18,38.73 63.18,35.24 62.23,34.29 59.05,34.29 57.78,35.56 R35.P$2
N$59  (via drill 0.3)
  Top 0.406: v103.82,69.22 103.82,66.04 100.01,62.23 100.01,48.9 102.55,46.35 R34.P$2
  Bottom 0.406: v103.82,69.22 104.78,70.17 107.95,70.17 109.54,68.58 110.17,68.58 IC8.13
N$60  (via drill 0.3)
  Top 0.406: v100.65,55.56 100.65,51.75 106.05,46.35 R33.P$2
  Bottom 0.406: v100.65,55.56 100.65,61.91 101.92,63.18 102.55,63.18 107.63,68.26 IC8.14
N$61
  Top 0.406: IC8.15 105.09,68.26 105.09,66.36 100.97,62.23 100.97,57.78 104.14,54.61 104.14,52.07 109.86,46.35 R32.P$2
N$62
  Top 0.406: IC8.12 112.71,68.26 107,62.55 102.23,62.55 101.6,61.91 101.6,58.1 104.78,54.93 104.78,53.34 111.76,46.35 113.67,46.35 R31.P$2
N$63
  Top 0.406: IC8.1 102.87,60.64 108.27,55.24 110.49,55.24 117.47,48.26 117.47,45.72 118.43,44.77 129.22,44.77 130.49,46.04 R30.P$2
N$64
  Top 0.406: IC8.5 113.03,60.64 113.03,56.52 118.75,50.8 118.75,46.35 R29.P$2
N$65
  Bottom 0.406: IC8.2 105.41,60.64 110.81,55.24 119.38,55.24 126.68,47.94 126.68,46.35 R28.P$2
N$66
  Top 0.406: IC8.4 110.49,60.96 112.08,62.55 113.03,62.55 114.3,61.28 114.3,56.2 122.87,47.62 122.87,46.35 R27.P$2
N$67  (via drill 0.3)
  Top 0.406: v71.12,50.16 56.52,64.77 56.52,77.79 55.56,78.74 41.91,78.74 41.27,78.11 41.27,74.61 34.29,67.63 29.21,67.63 27.3,69.53 IC7.7
  Bottom 0.406: v71.12,50.16 71.12,45.4 78.74,37.78 S9.2
N$68  (via drill 0.3)
  Top 0.406: v28.57,65.09 28.57,64.45 33.02,60.01 38.42,60.01 41.27,57.15 41.27,53.02 v46.99,47.31 | S9.7 91.44,37.78 89.22,37.78 S9.6
  Bottom 0.406: v28.57,65.09 26.99,66.67 22.54,66.67 19.68,69.53 IC7.4 | v46.99,47.31 47.31,47.31 53.02,41.59 53.02,37.47 57.47,33.02 84.45,33.02 88.9,37.47 S9.6
N$69  (via drill 0.3)
  Top 0.406: v98.42,30.16 83.19,30.16 74.3,21.27 69.85,21.27 68.58,20 POT3.P$2
  Bottom 0.406: v98.42,30.16 104.46,30.16 115.25,40.96 116.2,40.96 Q6.3 | S3.3 65.72,15.88 65.72,17.14 68.26,19.68 POT3.P$2
VCC  (via drill 0.3)
  Top 0.406: POT9_PWM.P$1 23.18,19.05 17.46,19.05 11.75,24.77 10.16,24.77 9.21,25.72 IC5.8 | 4.13,39.05 5.4,39.05 R6.P$2 | 4.13,39.05 2.22,39.05 R23.P$2 | 10.16,65.09 13.97,65.09 IC1.8 | 4.76,70.48 4.45,70.8 POWER.+ 4.76,70.48 | 4.76,70.48 10.16,65.09 | 4.76,70.48 5.08,70.48 11.75,77.15 IC7.16 | 36.51,65.72 38.73,65.72 39.69,64.77 IC3.8 40.01,64.45 40.96,63.5 42.55,63.5 v49.21,56.83 | 36.51,65.72 28.26,65.72 27.62,65.09 27.62,64.77 IC2.8 | 36.51,65.72 42.23,71.44 42.23,76.83 IC6.14 | 4.13,39.05 4.13,54.29 10.16,60.33 10.16,65.09
  Bottom 0.406: 5.71,36.83 5.71,39.05 R6.P$2 | 5.71,36.83 5.71,31.11 8.89,27.94 8.89,26.04 IC5.8 | 5.71,36.83 8.89,36.83 IC4.8 | IC8.16 102.55,68.58 62.55,68.58 55.88,75.25 44.13,75.25 42.55,76.83 IC6.14 | v49.21,56.83 61.59,44.45 61.59,43.5 R1.P$2 | IC1.8 14.29,65.09 15.24,65.09 16.19,66.04 26.04,66.04 27.3,64.77 IC2.8

### Text on the board
tPlace: Towards new universes of sound / TALLER BOCUMA GDL MX 2019. | "BEWARE; / FOR I AM / FEARLESS, / AND THEREFORE / POWERFUL." / - FRANKENSTEIN. | FRANKIE V1.0 REV B DIY KIT ED. (CC BY-NC-SA 4-0).
bPlace: This work is shared under a CC License. Attribution-NonCommercial-ShareAlike 4.0 Intl. (CC BY-NC-SA 4.0).